# EAGLE design pluvionV0 (EAGLE 7.3.0)
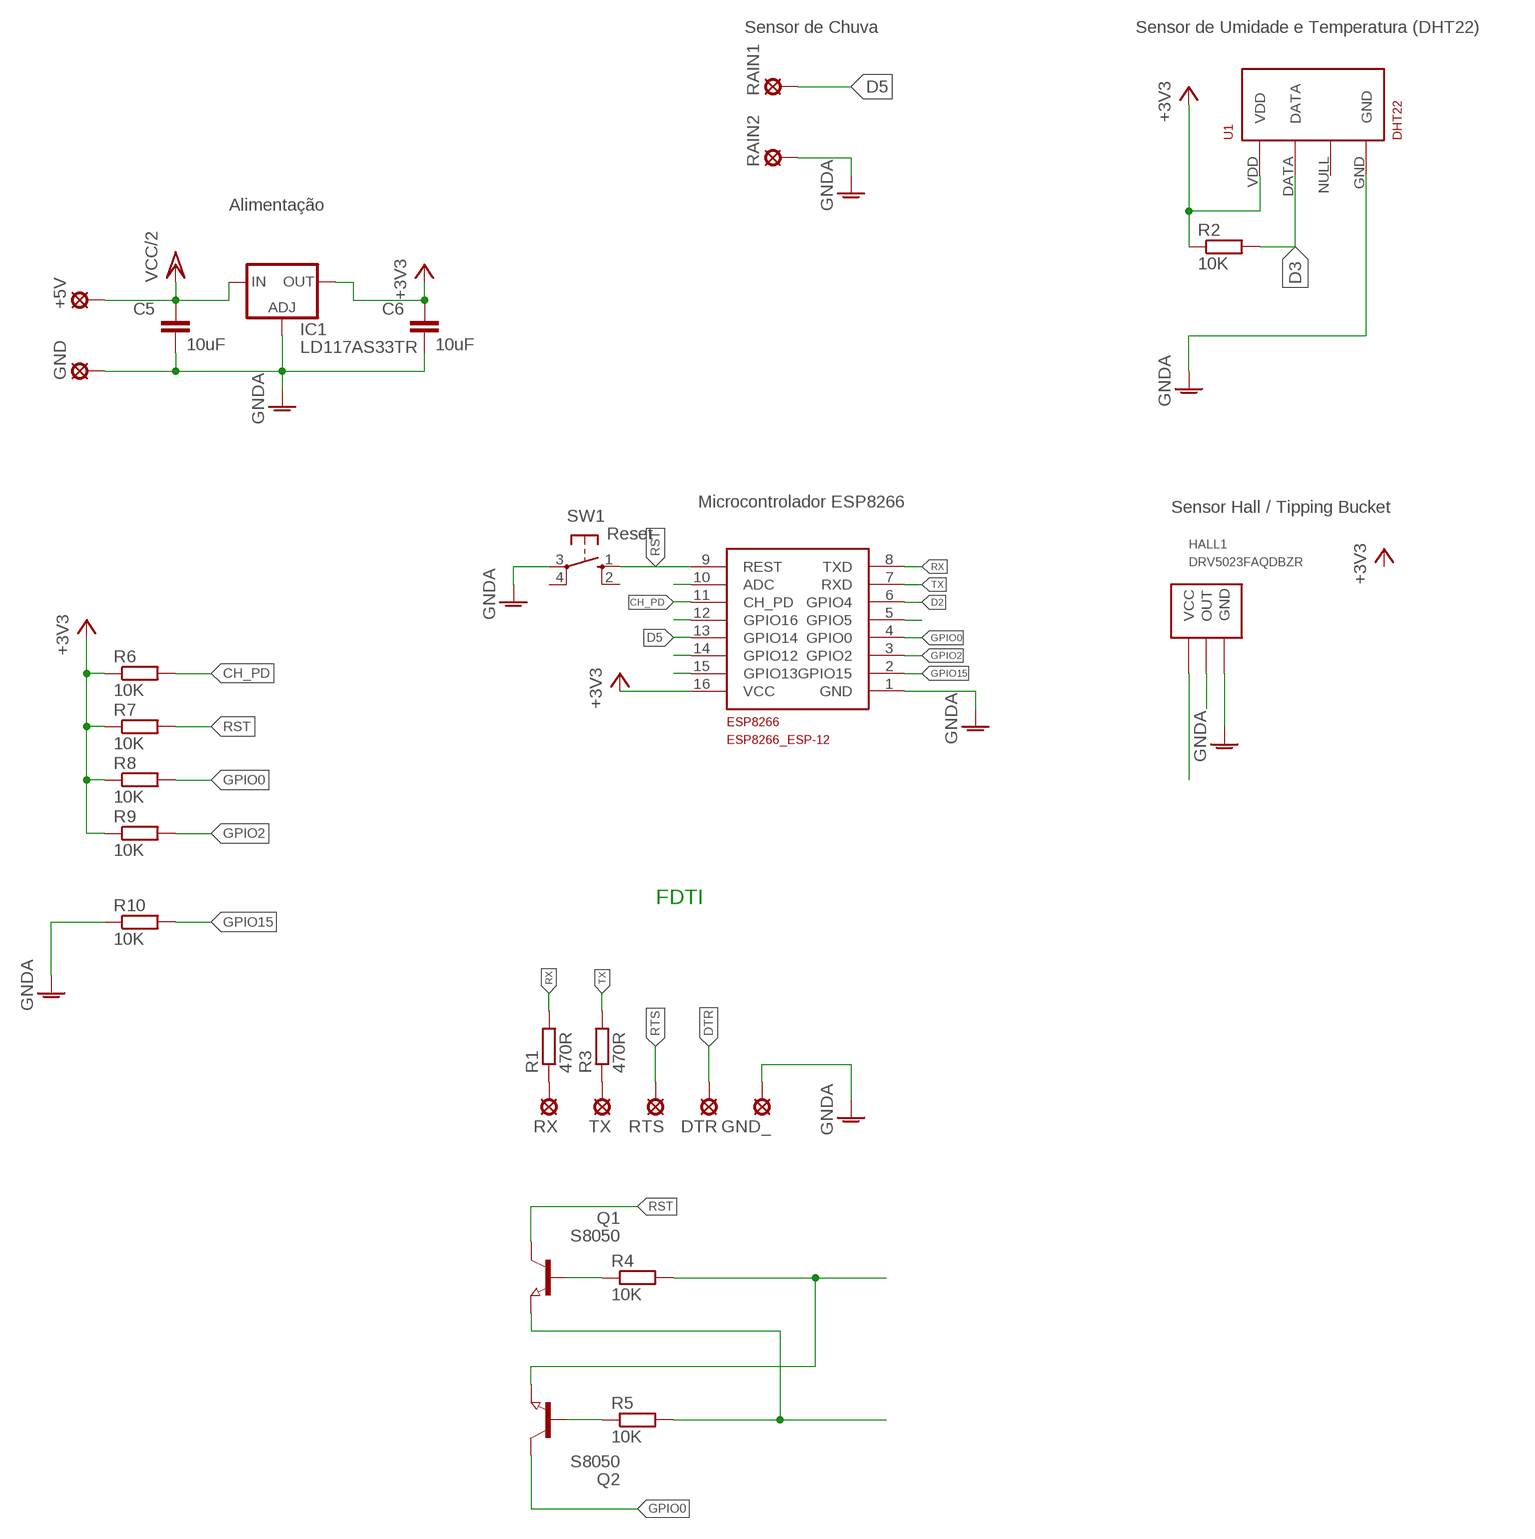
[diagram p0: schematic, sheet 1]

## Parts
+5V  LSP10  [LSP10]
C5  10uF  C-EUC0805K  [C0805K]
C6  10uF  C-EUC0805K  [C0805K]
DTR  LSP10  [LSP10]
ESP8266  ESP8266_ESP-12  [ESP8266-ESP12]
GND  LSP10  [LSP10]
GND_  LSP10  [LSP10]
HALL1  DRV5023FAQDBZR  [SOT23]
IC1  LD117AS33TR  [SOT223]
Q1  S8050  NPN-TRANSISTOR_SOT23  [SOT23]
Q2  S8050  NPN-TRANSISTOR_SOT23  [SOT23]
R1  470R  R-EU_M1206  [M1206]
R2  10K  R-EU_M1206  [M1206]
R3  470R  R-EU_M1206  [M1206]
R4  10K  R-EU_M1206  [M1206]
R5  10K  R-EU_M1206  [M1206]
R6  10K  R-EU_M1206  [M1206]
R7  10K  R-EU_M1206  [M1206]
R8  10K  R-EU_M1206  [M1206]
R9  10K  R-EU_M1206  [M1206]
R10  10K  R-EU_M1206  [M1206]
RAIN1  LSP10  [LSP10]
RAIN2  LSP10  [LSP10]
RTS  LSP10  [LSP10]
RX  LSP10  [LSP10]
SW1  Reset  10-XX  [B3F-10XX]
TX  LSP10  [LSP10]
U1  DHT22  RHT03_DHT-22_AM2302RA  [RHT03_DHT-22/RA]

## Nets
+3V3: C6.1 ESP8266.16(VCC) IC1.4(OUT) R2.1 R6.1 R7.1 R8.1 R9.1 U1.VDD
CH_PD: ESP8266.11(CH_PD) R6.2
D2: ESP8266.6(GPIO4)
D3: R2.2 U1.DATA
D5: ESP8266.13(GPIO14) RAIN1.MP
DTR: DTR.MP Q2.2(E) R4.2
GND: C5.2 C6.2 ESP8266.1(GND) GND.MP IC1.1(ADJ) RAIN2.MP SW1.3(P) U1.GND ; supply symbol labelled GNDA
GNDA: GND_.MP HALL1.3(GND) R10.1
GPIO0: ESP8266.4(GPIO0) Q2.3(C) R8.2
GPIO2: ESP8266.3(GPIO2) R9.2
GPIO15: ESP8266.2(GPIO15) R10.2
N$1: HALL1.2(OUT)
N$2: HALL1.1(VCC)
N$3: R1.1 RX.MP
N$4: Q1.1(B) R4.1
N$5: R3.1 TX.MP
N$7: Q2.1(B) R5.1
N$9: ESP8266.5(GPIO5)
N$10: ESP8266.15(GPIO13)
N$11: ESP8266.12(GPIO16)
N$12: ESP8266.14(GPIO12)
N$14: ESP8266.10(ADC)
RST: ESP8266.9(REST) Q1.3(C) R7.2 SW1.1(S)
RTS: Q1.2(E) R5.2 RTS.MP
RX: ESP8266.8(TXD) R1.2
TX: ESP8266.7(RXD) R3.2
VCC/2: +5V.MP C5.1 IC1.3(IN)
Unconnected: SW1.2(S1) SW1.4(P1) U1.NULL

## Notes on the sheet
- Sensor de Chuva | Sensor de Umidade e Temperatura (DHT22)
- Alimentação
- Microcontrolador ESP8266
- Sensor Hall / Tipping Bucket
- FDTI

## Library data of the parts
+5V DTR GND GND_ RAIN1 RAIN2 RTS RX TX = solpad:LSP10: SOLDER PAD drill 1.0 mm, distributor Buerklin, 12H555
C5 C6 = rcl:C-EU: CAPACITOR, European symbol
ESP8266 = ESP8266-ESP12:ESP8266_ESP-12
HALL1 = lib_pluvion:DRV5023FAQDBZR: Digital Switch Hall Sensor
IC1 = v-reg:LD117A?*: Low drop fixed and adjustable positive voltage regulators 1 A Source: http://www.st.com/stonline/products/literature/ds/7194/ld1117axx.pdf
Q1 Q2 = semicon-smd-ipc:NPN-TRANSISTOR_: NPN TRANSISTOR
R1-R10 = rcl:R-EU_: RESISTOR, European symbol
SW1 = buttons:10-XX: OMRON SWITCH
U1 = RHT03_DHT-22_AM2302:RHT03_DHT-22_AM2302: RHT03 / DHT-22 / AM2302 Packages and symbol for the RHT03 / DHT-22 relative humidity and temperature sensor. Note: The AM2302 is a wired version of the DHT-22 which typically requires less clearance and is thus provided as a separate package.; PROD_ID: SEN-10167

## Board
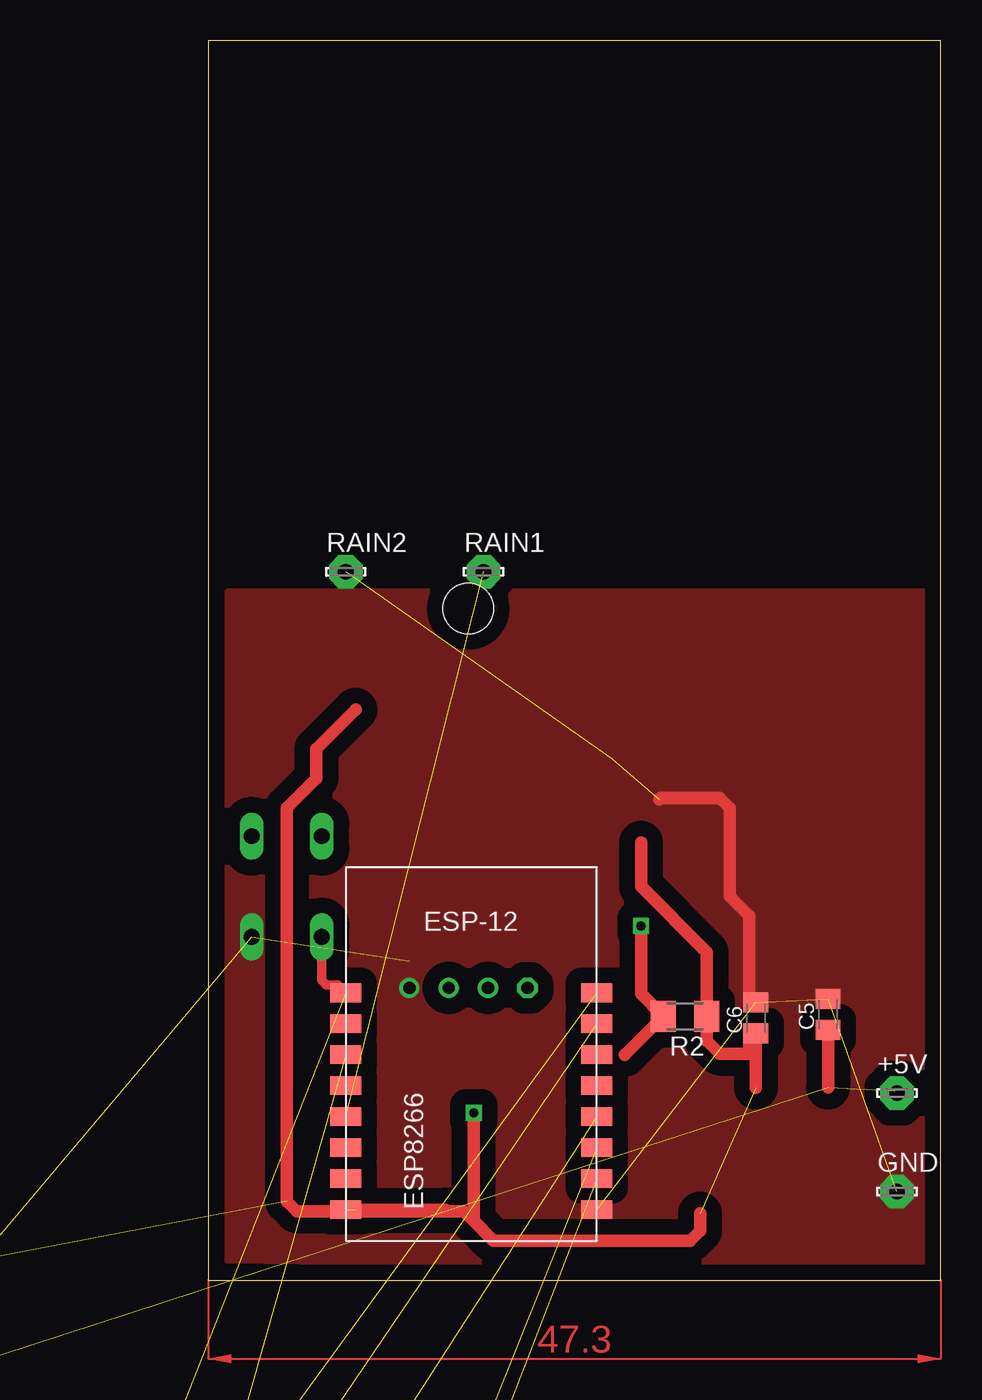
[diagram p1: board, top side]
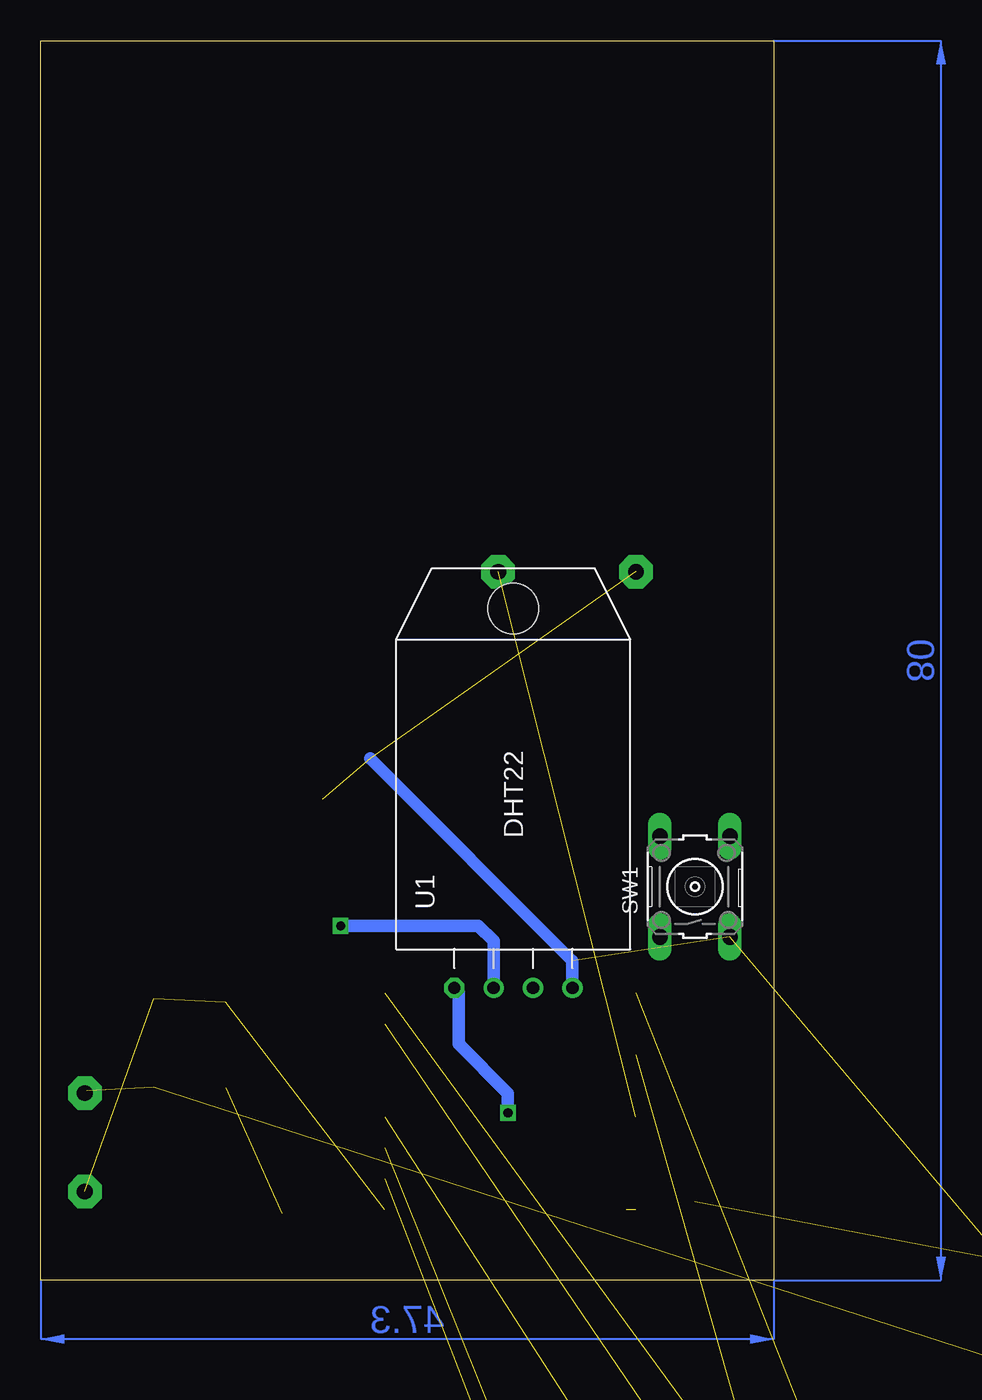
[diagram p2: board, bottom side, seen from below]

Size 47.3 x 80 mm. Coordinates in mm from the lower left corner, seen from the top.
Outline: 0,0 47.3,0 47.3,80 0,80 0,0
Copper layers (1*16): Top 0.035mm / dielectric 1.5mm / Bottom 0.035mm
Design rules "default": minimum track width 10mil, minimum drill 24mil, track to track 8mil, track to pad 8mil, pad to pad 8mil, via to via 8mil, smd to smd 8mil, copper to edge 40mil, drill to drill 8mil, minimum pad ring 10mil, minimum via ring 8mil, stop-mask expansion 4mil, vias tented up to drill 0mil, thermal gap 10mil

### Footprints (pad centres in the part's own frame; a part is rotated, then mirrored left to right if it is on the bottom)
LSP10 = drill 1.016 pad 2.159 octagon: MP 0,0
C0805K = smd 1.3 x 1.6: 1 -1,0; 2 1,0
ESP8266-ESP12 = smd 2 x 1.2: 1 16.2,2; 2 16.2,4; 3 16.2,6; 4 16.2,8; 5 16.2,10; 6 16.2,12; 7 16.2,14; 8 16.2,16; 9 0,16; 10 0,14; 11 0,12; 12 0,10; 13 0,8; 14 0,6; 15 0,4; 16 0,2
SOT23 = smd 1 x 1.4: 1 -0.95,-1.1; 2 0.95,-1.1; 3 0,1.1
SOT223 = smd 1.5 x 2: 1 -2.3,-3.15; 2 0,-3.15; 3 2.3,-3.15 | smd 3.8 x 2: 4 0,3.15
M1206 = smd 1.6 x 2: 1 -1.4,0; 2 1.4,0
B3F-10XX = drill 1.016 long: 1 -3.251,2.261; 2 3.251,2.261; 3 -3.251,-2.261; 4 3.251,-2.261
RHT03_DHT-22/RA = drill 0.8: DATA -1.27,0; GND 3.81,0; NULL 1.27,0 | drill 0.8 octagon: VDD -3.81,0 | hole 3.25: 0,24.5

### Placement (x,y rotation side)
+5V  44.45,12.06 0 top
C5  40.01,17.14 90 top
C6  35.35,16.92 90 top
DTR  -19.68,-31.11 0 top  (outside the outline)
ESP8266  8.89,2.54 0 top
GND  44.45,5.71 0 top
GND_  -19.68,-35.56 0 top  (outside the outline)
HALL1  -19.05,-10.79 0 top  (outside the outline)
IC1  -18.41,-2.54 0 top  (outside the outline)
Q1  -19.05,-53.34 0 top  (outside the outline)
Q2  -19.05,-59.05 0 top  (outside the outline)
R1  -19.05,-40.01 0 top  (outside the outline)
R2  30.78,17.02 180 top
R3  -19.05,-46.35 0 top  (outside the outline)
R4  -19.05,-66.04 0 top  (outside the outline)
R5  -19.05,-72.39 0 top  (outside the outline)
R6  -19.05,-78.74 0 top  (outside the outline)
R7  -19.05,-85.09 0 top  (outside the outline)
R8  -19.05,-91.44 0 top  (outside the outline)
R9  -19.05,-97.79 0 top  (outside the outline)
R10  -19.05,-104.14 0 top  (outside the outline)
RAIN1  17.78,45.72 0 top
RAIN2  8.89,45.72 0 top
RTS  -19.68,-26.67 0 top  (outside the outline)
RX  -19.68,-17.78 0 top  (outside the outline)
SW1  5.08,25.4 90 bottom
TX  -19.68,-22.23 0 top  (outside the outline)
U1  16.8,18.86 0 bottom

### Tracks (layer width: path | path; a pad name or v marks a point on that pad's centre or on a via)
+3V3  (via drill 0.6)  (7 unrouted)
  Top 0.813: 35.35,12.41 C6.1 34.92,15.49 34.92,14.61 33.02,14.61 32.18,15.45 R2.1 32.18,21.16 27.94,25.4 27.94,28.25 | 15.34,4.54 9.53,4.54 9.62,4.45 | 17.14,3.81 v17.14,10.79 | 17.14,3.81 18.41,2.54 31.11,2.54 31.75,3.17 31.75,4.3 | 17.14,3.81 16.51,4.45 9.62,4.45 | 9.53,36.83 6.99,34.29 6.99,32.38 5.08,30.48 5.08,5.08 5.71,4.45 9.62,4.45
  Bottom 0.813: v17.14,10.79 17.14,12.06 20.32,15.24 20.32,18.57 U1.VDD
CH_PD  (1 unrouted)
D3  (via drill 0.6)
  Top 0.813: 26.9,14.54 R2.2 27.94,18.46 v27.94,22.86
  Bottom 0.813: U1.DATA 18.07,21.88 19.05,22.86 v27.94,22.86
D5  (1 unrouted)
DTR  (2 unrouted)
GND  (7 unrouted)
  Top 0.813: 29.12,31.03 29.21,31.11 33.02,31.11 33.66,30.48 33.66,24.77 34.92,23.5 34.92,18.34 C6.2
  Bottom 0.813: U1.GND 12.99,20.61 26.04,33.66
  pour Top (isolate 1.016, no thermals): 1.27,44.45 1.27,1.27 46.99,0.64 46.99,44.45
GNDA  (2 unrouted)
GPIO0  (2 unrouted)
GPIO2  (1 unrouted)
GPIO15  (1 unrouted)
N$3  (1 unrouted)
N$4  (1 unrouted)
N$5  (1 unrouted)
N$7  (1 unrouted)
RST  (2 unrouted)
  Top 0.61: SW1.1 7.34,19.33 7.62,19.05 8.38,19.05 ESP8266.9
RTS  (2 unrouted)
RX  (1 unrouted)
TX  (1 unrouted)
VCC/2  (2 unrouted)
  Top 0.813: C5.1 40.01,12.44 | 44.31,12.2 +5V.MP
(copper drawn outside any net)
  shapes: Bottom area x2, Top area x1